# Altium schematic sheet CAN.SchDoc: MCP2515 CAN BUS
size 420 x 297 mm; SheetNumber: 6; SheetTotal: 8
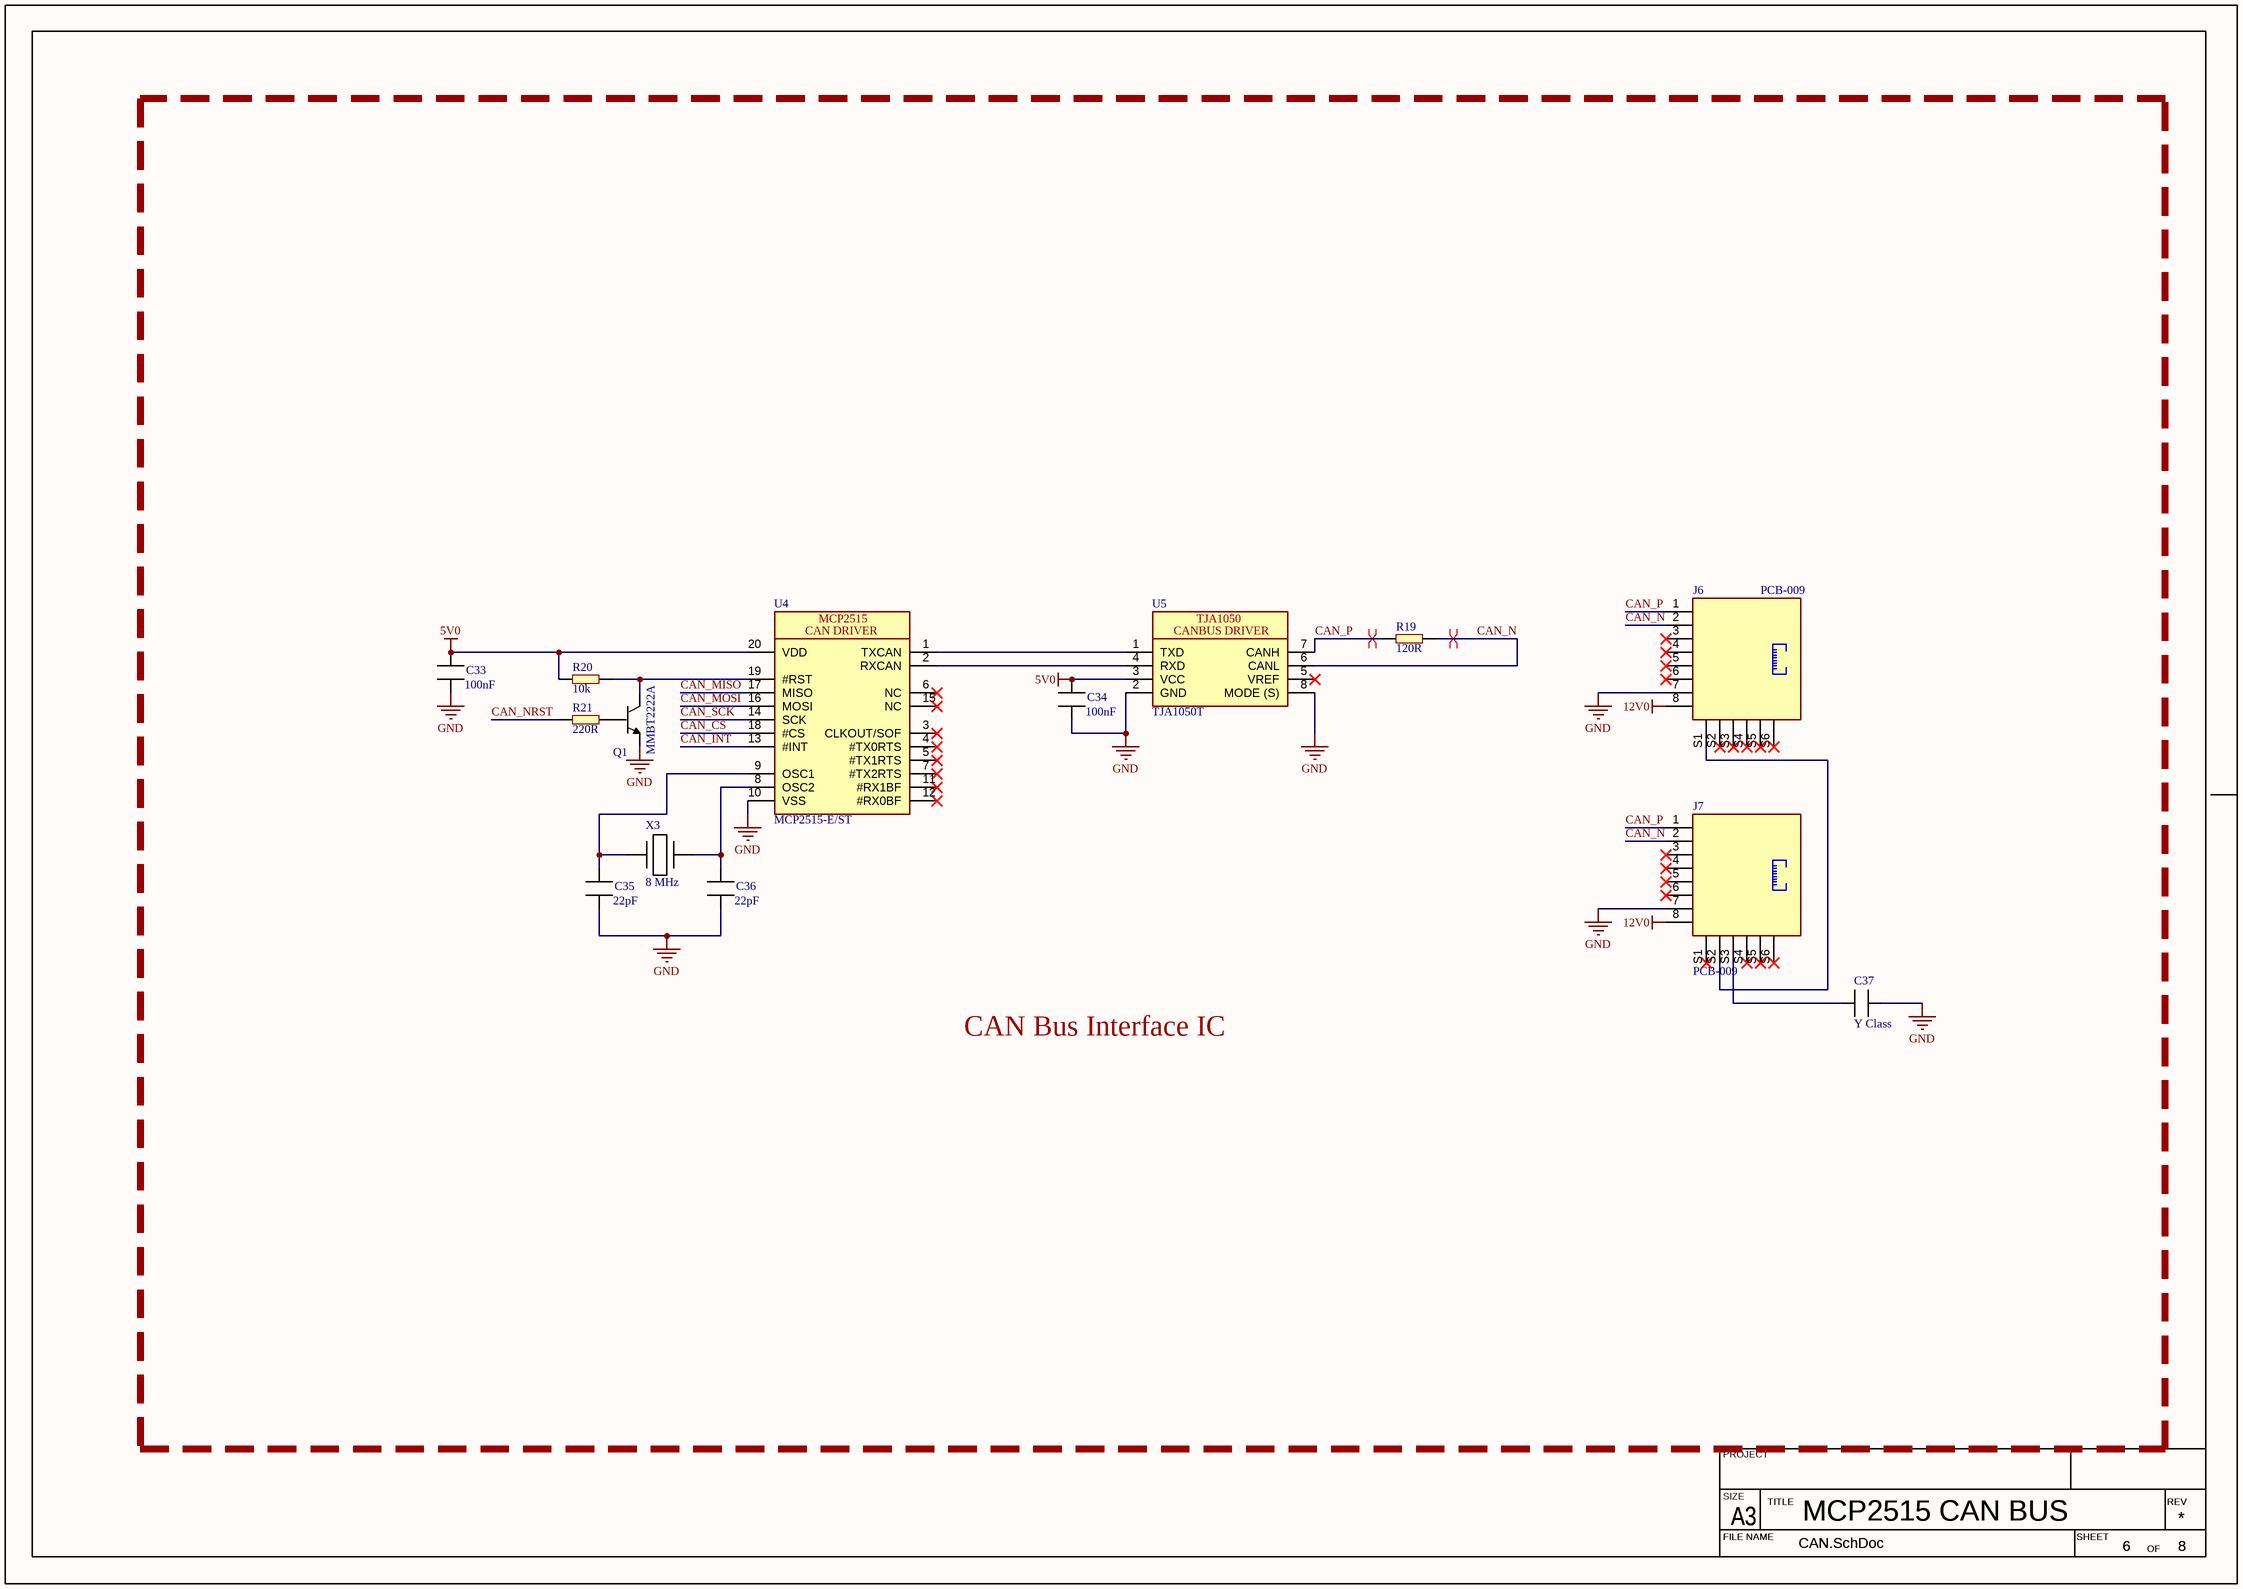
[diagram p0: CAN.SchDoc]

## Parts
C33  value 100nF  [CAPC2012X13L]  (hidden comment: MLCC_0805)
C34  value 100nF  [CAPC2012X13L]  (hidden comment: MLCC_0805)
C35  value 22pF  [CAPC2012X13L]  (hidden comment: MLCC_0805)
C36  value 22pF  [CAPC2012X13L]  (hidden comment: MLCC_0805)
C37  value Y Class  [VY1222M43Y5UC63V0]  (hidden comment: VY1)
J6  value PCB-009  [PCB-009]  (hidden comment: ERP_148-3)
J7  value PCB-009  [PCB-009]  (hidden comment: ERP_148-3)
Q1  value MMBT2222A  [MMBT2222]  (hidden comment: ERP_105-1)
R19  value 120R  [RES_0603]  (hidden comment: ERP_101-1)
R20  value 10k  [RES_0603]  (hidden comment: ERP_101-1)
R21  value 220R  [RES_0603]  (hidden comment: ERP_101-1)
U4  value MCP2515-E/ST  [MCP2515-ST]  (hidden comment: MCP2515)
U5  value TJA1050T  [TJA1050T]  (hidden comment: TJA1050)
X3  value 8 MHz  [HC-49US]  (hidden comment: HC-49US)

## Blocks framed on the sheet
CAN Bus Interface IC: C33-C37 J6 J7 Q1 R19-R21 U4 U5 X3

## Nets
5V0: C33.1 C34.1 R20.1 U4.20(VDD) U5.3(VCC)
12V0: J6.8 J7.8
GND: C33.2 C34.2 C35.2 C36.2 C37.2 J6.7 J7.7 Q1.2 U4.10(VSS) U5.2(GND) U5.8(MODE_(S))
CAN_CS: U4.18(#CS)
CAN_INT: U4.13(#INT)
CAN_MISO: U4.17(MISO)
CAN_MOSI: U4.16(MOSI)
CAN_N: J6.2 J7.2 R19.2 U5.6(CANL)
CAN_NRST: R21.1
CAN_P: J6.1 J7.1 R19.1 U5.7(CANH)
CAN_SCK: U4.14(SCK)
NetC35_1: C35.1 U4.9(OSC1) X3.1
NetC36_1: C36.1 U4.8(OSC2) X3.2
NetC37_1: C37.1 J7.S3
NetJ6_S1: J6.S1 J7.S2
NetQ1_1: Q1.1 R21.2
NetQ1_3: Q1.3 R20.2 U4.19(#RST)
NetU4_1: U4.1(TXCAN) U5.1(TXD)
NetU4_2: U4.2(RXCAN) U5.4(RXD)

Not connected (* = marked no-connect by the designer): J6 3* 4* 5* 6* S2* S3* S4* S5* S6*; J7 3* 4* 5* 6* S1* S4* S5* S6*; U4 3(CLKOUT/SOF)* 4(#TX0RTS)* 5(#TX1RTS)* 6(NC)* 7(#TX2RTS)* 11(#RX1BF)* 12(#RX0BF)* 15(NC)*; U5 5(VREF)*

## Layout directives
differential pair; differential pair class CAN_120R; rule Differential Pairs Routing [Pref Gap = 10mil    Min Gap  = 10mil    Max Gap  = 10milPref Width = 16.535mil    Min Width  = 16.535mil    Max Width  = 16.535mil]: CAN_N, CAN_P

## Notes on the sheet
- PROJECT
- SIZE
- FILE NAME
- A3
- TITLE
- SHEET
- OF
- REV
- (in symbol MCP2515) CAN DRIVER
- (in symbol TJA1050) CANBUS DRIVER

## Library data of the parts
C33-C36 = MLCC_0805: Chip Capacitor, 2-Leads, Body 2.00x1.25mm, IPC High Density; Package: 0805; Manufacturer 1: *; Manufacturer Part Number 1: *
C37 = VY1: Ceramic Capacitor Y5U (E) Radial, Disc; Manufacturer 1: *; Manufacturer Part Number 1: *
J6 J7 = RJ45_Top_Entry: PCB-009 Robu; Manufacturer Part Number 1: *; Manufacturer 1: *; Supplier Part Number 1: *; Supplier 1: *; ERP: *; Package: 8P8C
Q1 = MMBT2222: MMBT2222A; ERP: *; Suuplier Part Number 1: *; Supplier 1: *; Manufacturer Part Number 1: *; Manufacturer 1: *; Package: SOT23
R19 = RES_0603: Manufacturer Part Number 1: 560112116003; Package: 0603; Manufacturer 1: *
R20 R21 = RES_0603: Package: 0603; Manufacturer 1: *; Manufacturer Part Number 1: *
U4 = MCP2515: CAN Interface IC; Manufacturer 1: *; Manufacturer Part Number 1: *
U5 = TJA1050: CAN Transceiver IC; Manufacturer 1: *; Manufacturer Part Number 1: *
X3 = HC-49US: CRYSTAL HC-49US 2 Pin; Package: HC-49US; ERP: *; Manufacturer Part Number 1: *; Manufacturer 1: *